# Altium schematic sheet OTHERTEST_0.SchDoc
size 223 x 145 mm
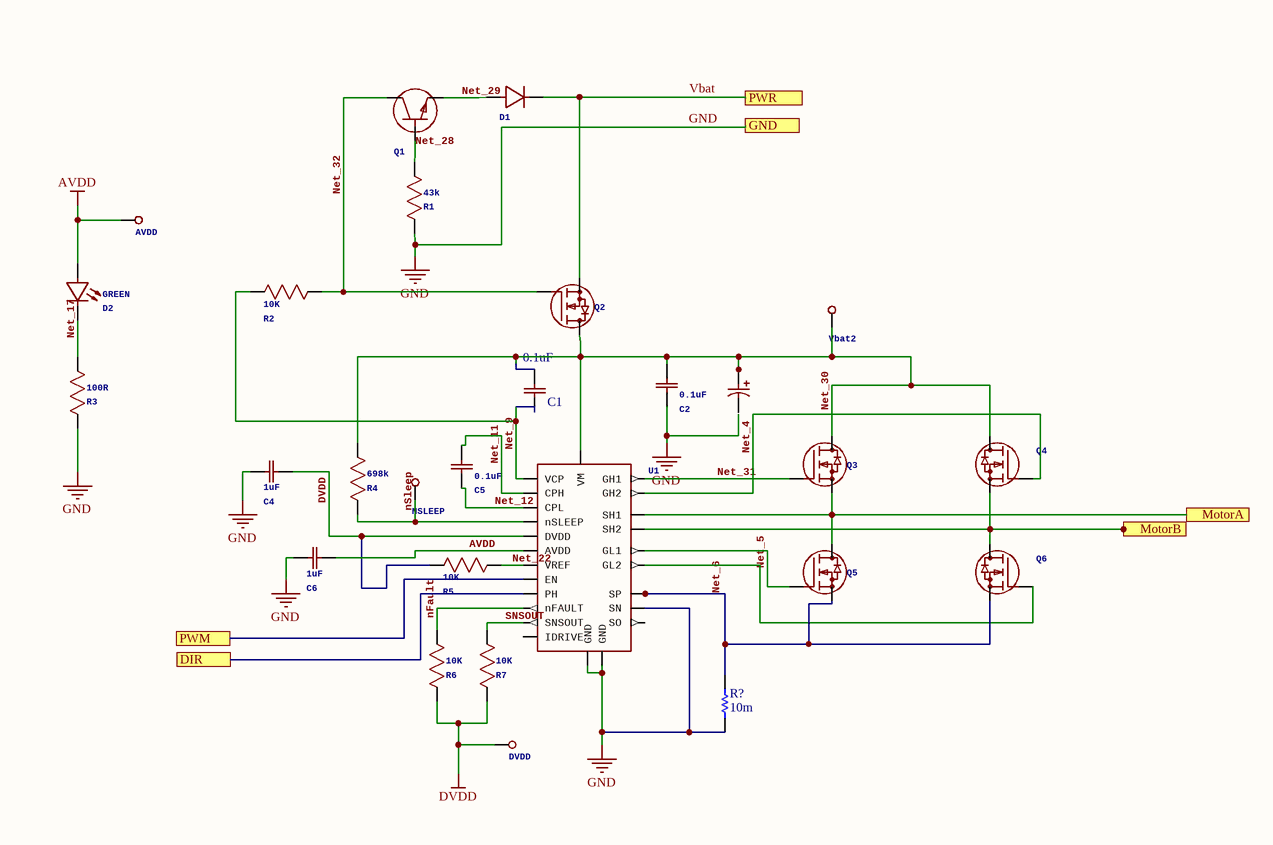
[diagram p0: OTHERTEST_0.SchDoc]

## Parts
AVDD  NAME: AVDD  [TESTPAD_1.5mm]  (hidden comment: TESTPOINT)
C1  0.1uF  [CAPC0603(1608)55_N]
C2  0.1uF  NAME: C2  [CAPC0603(1608)55_N]
C3  1000uF  [CAPR-2/4h6.8]  (value not drawn)
C4  1uF  NAME: C4  [CAPC0603(1608)55_N]
C5  0.1uF  NAME: C5  [CAPC0603(1608)55_N]
C6  1uF  NAME: C6  [CAPC0603(1608)55_N]
D1  NAME: D1  [DIODSOD-123]  (hidden comment: BAS16GW)
D2  GREEN  NAME: D2  [LED_0805_LINE]
DVDD  NAME: DVDD  [TESTPAD_1.5mm]  (hidden comment: TESTPOINT)
NSLEEP  NAME: NSLEEP  [TESTPAD_1.5mm]  (hidden comment: TESTPOINT)
Q1  NAME: Q1  [SOT23-3]  (hidden comment: NPN_40V_100MA)
Q2  NAME: Q2  [SOT404]  (hidden comment: NMOS_40V_75A)
Q3  NAME: Q3  [SOT404]  (hidden comment: NMOS_40V_75A_3)
Q4  NAME: Q4  [SOT404]  (hidden comment: NMOS_40V_75A_4)
Q5  NAME: Q5  [SOT404]  (hidden comment: NMOS_40V_75A_3)
Q6  NAME: Q6  [SOT404]  (hidden comment: NMOS_40V_75A_4)
R1  43k  NAME: R1  [RESC0603(1608)_N]
R2  10K  NAME: R2  [RES_0603]
R3  100R  NAME: R3  [RESC0603(1608)_N]
R4  698k  NAME: R4  [RESC0603(1608)_N]
R5  10K  NAME: R5  [RESC0603(1608)_N]
R6  10K  NAME: R6  [RESC0603(1608)_N]
R7  10K  NAME: R7  [RESC0603(1608)_N]
R?  value 10m  [STAC-CSS2725-099H_V]  (hidden comment: RES_10m_2728)
U1  NAME: U1  [VFQFPN-24_N]  (hidden comment: DRV8701E)
Vbat2  NAME: Vbat2  [TESTPAD_1.5mm]  (hidden comment: TESTPOINT)

## Ports
DIR, GND, MotorA, MotorB, PWM, PWR

## Nets
AVDD: AVDD.1 C6.2 D2.1(A) U1.7(AVDD)
DVDD: C4.1 DVDD.1 R5.1 R6.2 R7.2 U1.8(DVDD)
GND: C2.2 C4.2 C6.1 R1.1 R3.1 R?.2 U1.5(GND) U1.16(GND) U1.20(SN) ; port GND
DIR: U1.15(PH) ; port DIR
MotorA: Q3.3(S) Q5.2(D) U1.18(SH1) ; port MotorA
MotorB: Q4.3(S) Q6.2(D) U1.23(SH2) ; port MotorB
Net_4: Q4.1(G) U1.24(GH2)
Net_5: Q5.1(G) U1.19(GL1)
Net_6: Q5.3(S) Q6.3(S) R?.1 U1.21(SP)
Net_9: C1.1 R2.1 U1.2(VCP)
Net_11: C5.2 U1.3(CPH)
Net_12: C5.1 U1.4(CPL)
Net_17: D2.2(K) R3.2
Net_22: R5.2 U1.6(VREF)
Net_28: Q1.1(B) R1.2
Net_29: D1.2(A) Q1.2(E)
Net_30: C1.2 C2.1 C3.2(PLUS) Q2.2(D) Q3.2(D) Q4.2(D) R4.1 U1.1(VM) Vbat2.1
Net_31: Q3.1(G) U1.17(GH1)
Net_32: Q1.3(C) Q2.1(G) R2.2
nFault: R6.1 U1.9(nFAULT)
nSleep: NSLEEP.1 R4.2 U1.13(nSLEEP)
PWM: U1.14(EN) ; port PWM
SNSOUT: R7.1 U1.10(SNSOUT)
Vbat: D1.1(K) Q2.3(S) ; port PWR
NetQ6_1: Q6.1(G) U1.22(GL2)

Not connected (* = marked no-connect by the designer): C3 1(MINUS); U1 11(SO) 12(IDRIVE)

## Library data of the parts
AVDD DVDD NSLEEP Vbat2 = TESTPOINT: GateName_1: PART_1; SymbolName_1: TESTPOINT; LibraryName: common; DeviceSetName: TESTPOINT
C1 = CAP_0.1UF_35V_0603: MANUFACTURER: Taiyo Yuden; MPN: GMK107B7104KAHT; GateName_1: PART_1; SymbolName_1: CAP_NONPOLARIZED; VOLTAGE: 35V; LibraryName: OTHERTEST; DeviceSetName: CAP_0.1UF_35V_0603; Package: CAP_0603_5
C2 C5 = CAP_0.1UF_0603: MANUFACTURER: Taiyo Yuden; MPN: GMK107B7104KAHT; GateName_1: PART_1; VOLTAGE: 35V; SymbolName_1: CAP_0.1UF_0603; LibraryName: common; DeviceSetName: CAP_0.1UF_0603
C3 = CAP_22UF_POL: MANUFACTURER: Wurth Electronics Inc; MPN: 860020672011; GateName_1: PART_1; ATTR_1: Electrolytic; SymbolName_1: CAP_22UF_POL; LibraryName: OTHERTEST; DeviceSetName: CAP_22UF_POL; DATASHEET: http://katalog.we-online.de/pbs/datasheet/860020672011.pdf; Package: CAPPR-2/4h6.8
C4 C6 = CAP_1UF_0603: MANUFACTURER: Yageo; MPN: CC0603ZRY5V7BB105; GateName_1: PART_1; SymbolName_1: CAP_1UF_0603; LibraryName: common; DeviceSetName: CAP_1UF_0603
D1 = BAS16GW: MANUFACTURER: Nexperia; GateName_1: PART_1; SymbolName_1: BAS16GW; LibraryName: common; DeviceSetName: BAS16GW; DATASHEET: https://assets.nexperia.com/documents/data-sheet/BAS16GW.pdf; MPN: BAS16GW
D2 = DIO_LED_G: MANUFACTURER: OSRAM; MPN: LG R971-KN-1; GateName_1: PART_1; SymbolName_1: DIO_LED_G; LibraryName: common; DeviceSetName: DIO_LED_G
Q1 = NPN_40V_100MA: MANUFACTURER: Micro Commercial Co; MPN: MMBT3904-TP; GateName_1: PART_1; SymbolName_1: NPN_40V_100MA; LibraryName: common; DeviceSetName: NPN_40V_100MA; DATASHEET: http://www.mccsemi.com/up_pdf/MMBT3904(SOT-23).pdf
Q2 = NMOS_40V_75A: MANUFACTURER: Nexperia; MPN: BUK768R1-40E; GateName_1: PART_1; SymbolName_1: NMOS_40V_75A; LibraryName: common; DeviceSetName: NMOS_40V_75A; DATASHEET: https://assets.nexperia.com/documents/data-sheet/BUK765R3-40E.pdf
Q3 Q5 = NMOS_40V_75A_3: MANUFACTURER: Nexperia; MPN: BUK768R1-40E; GateName_1: PART_1; SymbolName_1: NMOS_40V_75A_3_0; LibraryName: common; DeviceSetName: NMOS_40V_75A_3; DATASHEET: https://assets.nexperia.com/documents/data-sheet/BUK765R3-40E.pdf
Q4 Q6 = NMOS_40V_75A_4: MANUFACTURER: Nexperia; MPN: BUK768R1-40E; GateName_1: PART_1; SymbolName_1: NMOS_40V_75A_4_0; LibraryName: common; DeviceSetName: NMOS_40V_75A_4; DATASHEET: https://assets.nexperia.com/documents/data-sheet/BUK765R3-40E.pdf
R1 = RES_43K_0603: MANUFACTURER: Yageo; MPN: RC0603JR-0743KL; GateName_1: PART_1; SymbolName_1: RES_43K_0603; LibraryName: common; DeviceSetName: RES_43K_0603; DATASHEET: https://medhttp://www.yageo.com/documents/recent/PYu-RC_Group_51_RoHS_L_8.pdf
R2 R5-R7 = RES_10K_0603: MANUFACTURER: Yageo; MPN: RC0603JR-0710KL; GateName_1: PART_1; SymbolName_1: RES_10K_0603; LibraryName: common; DeviceSetName: RES_10K_0603
R3 = RES_100R_0603: MANUFACTURER: Yageo; MPN: RC0603FR-07100RL; GateName_1: PART_1; SymbolName_1: RES_100R_0603; LibraryName: common; DeviceSetName: RES_100R_0603
R4 = RES_698K_0603: MANUFACTURER: Yageo; MPN: RC0603FR-07698KL; GateName_1: PART_1; SymbolName_1: RES_698K_0603; LibraryName: common; DeviceSetName: RES_698K_0603; DATASHEET: http://www.yageo.com/documents/recent/PYu-RC_Group_51_RoHS_L_8.pdf
R? = RES_10m_2728: RES SMD 10mOHM 1% 4W 2728; Manufacturer: Yageo; Part Number (MPN): RC0603FR-07698KL; Package: 0603 (1608 Metric); Dimensions: 0.063" L x 0.031" W (1.60mm x 0.80mm); Tolerance: 1%; Supplier 1: Digi-Key; Supplier Part Number 1: CSSH2728FT10L0DKR-ND
U1 = DRV8701E: MANUFACTURER: Texas Instruments; MPN: DRV8701ERGET; GateName_1: PART_1; SymbolName_1: DRV8701E; LibraryName: common; DeviceSetName: DRV8701E